# Altium schematic sheet 宠物机器人&导购机器人.SchDoc
size A2
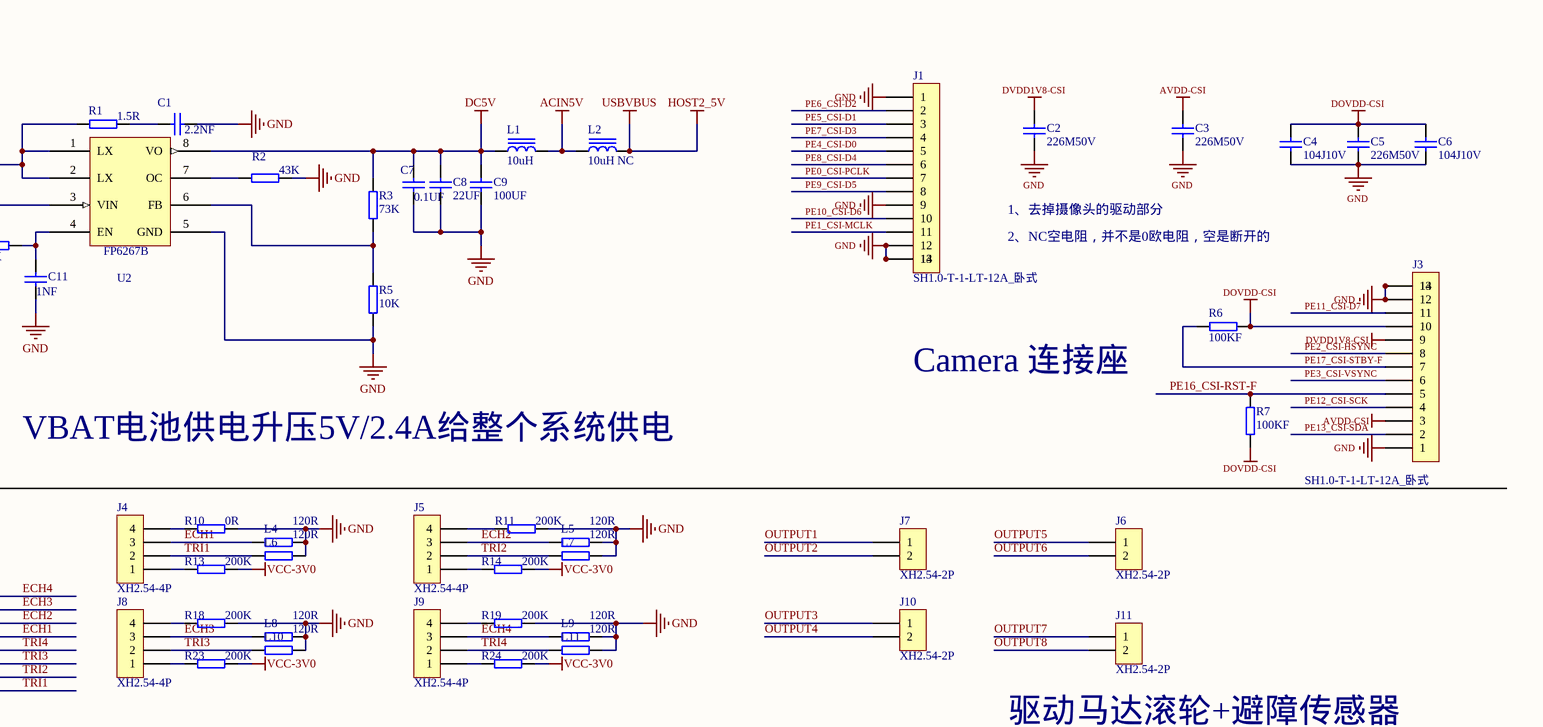
[diagram p0: 宠物机器人&导购机器人.SchDoc, top right]
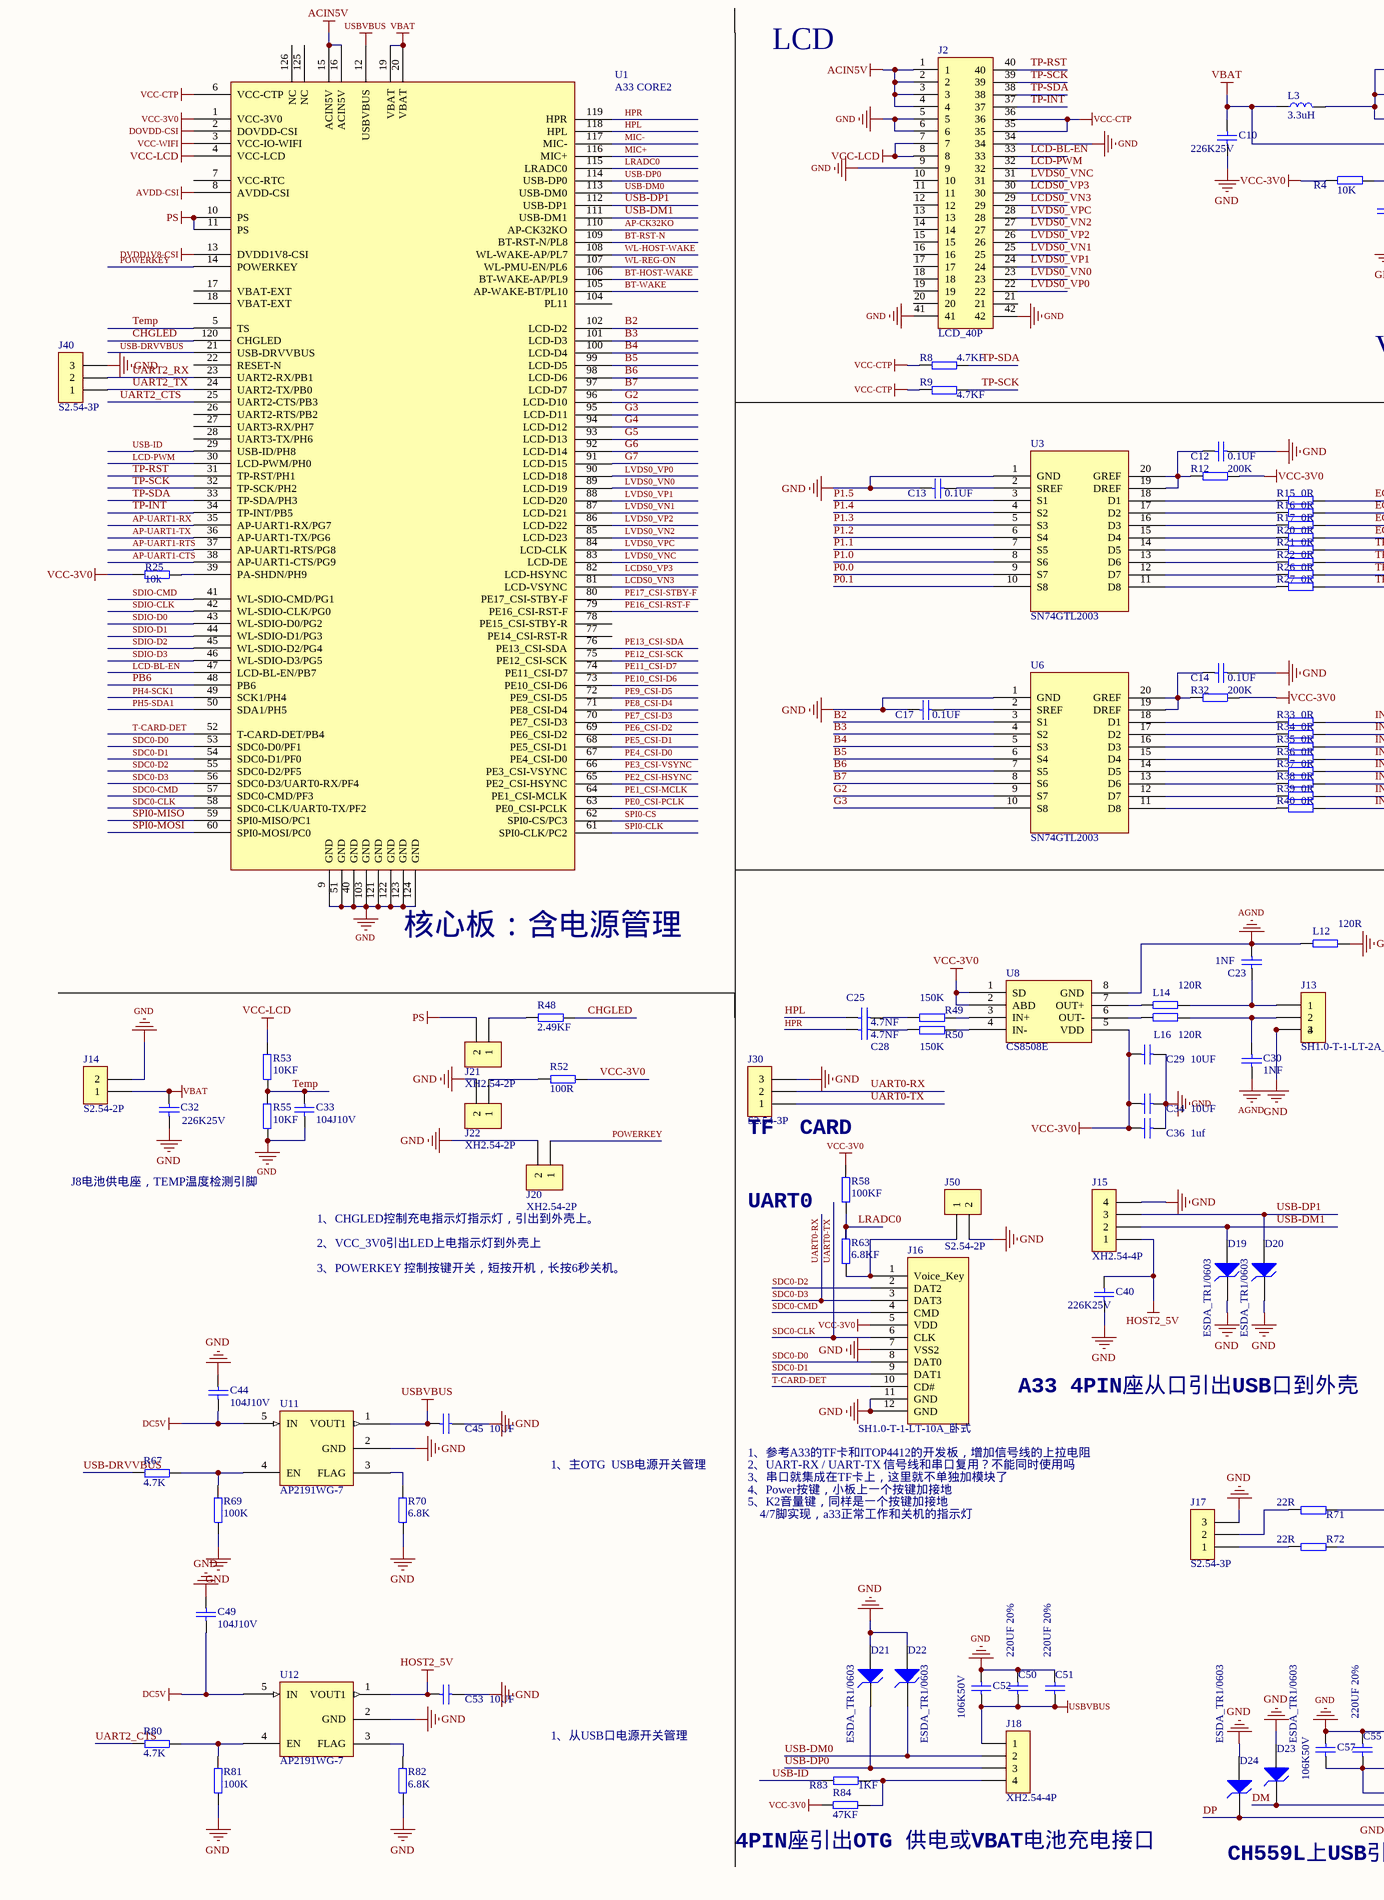
[diagram p1: 宠物机器人&导购机器人.SchDoc, bottom left]
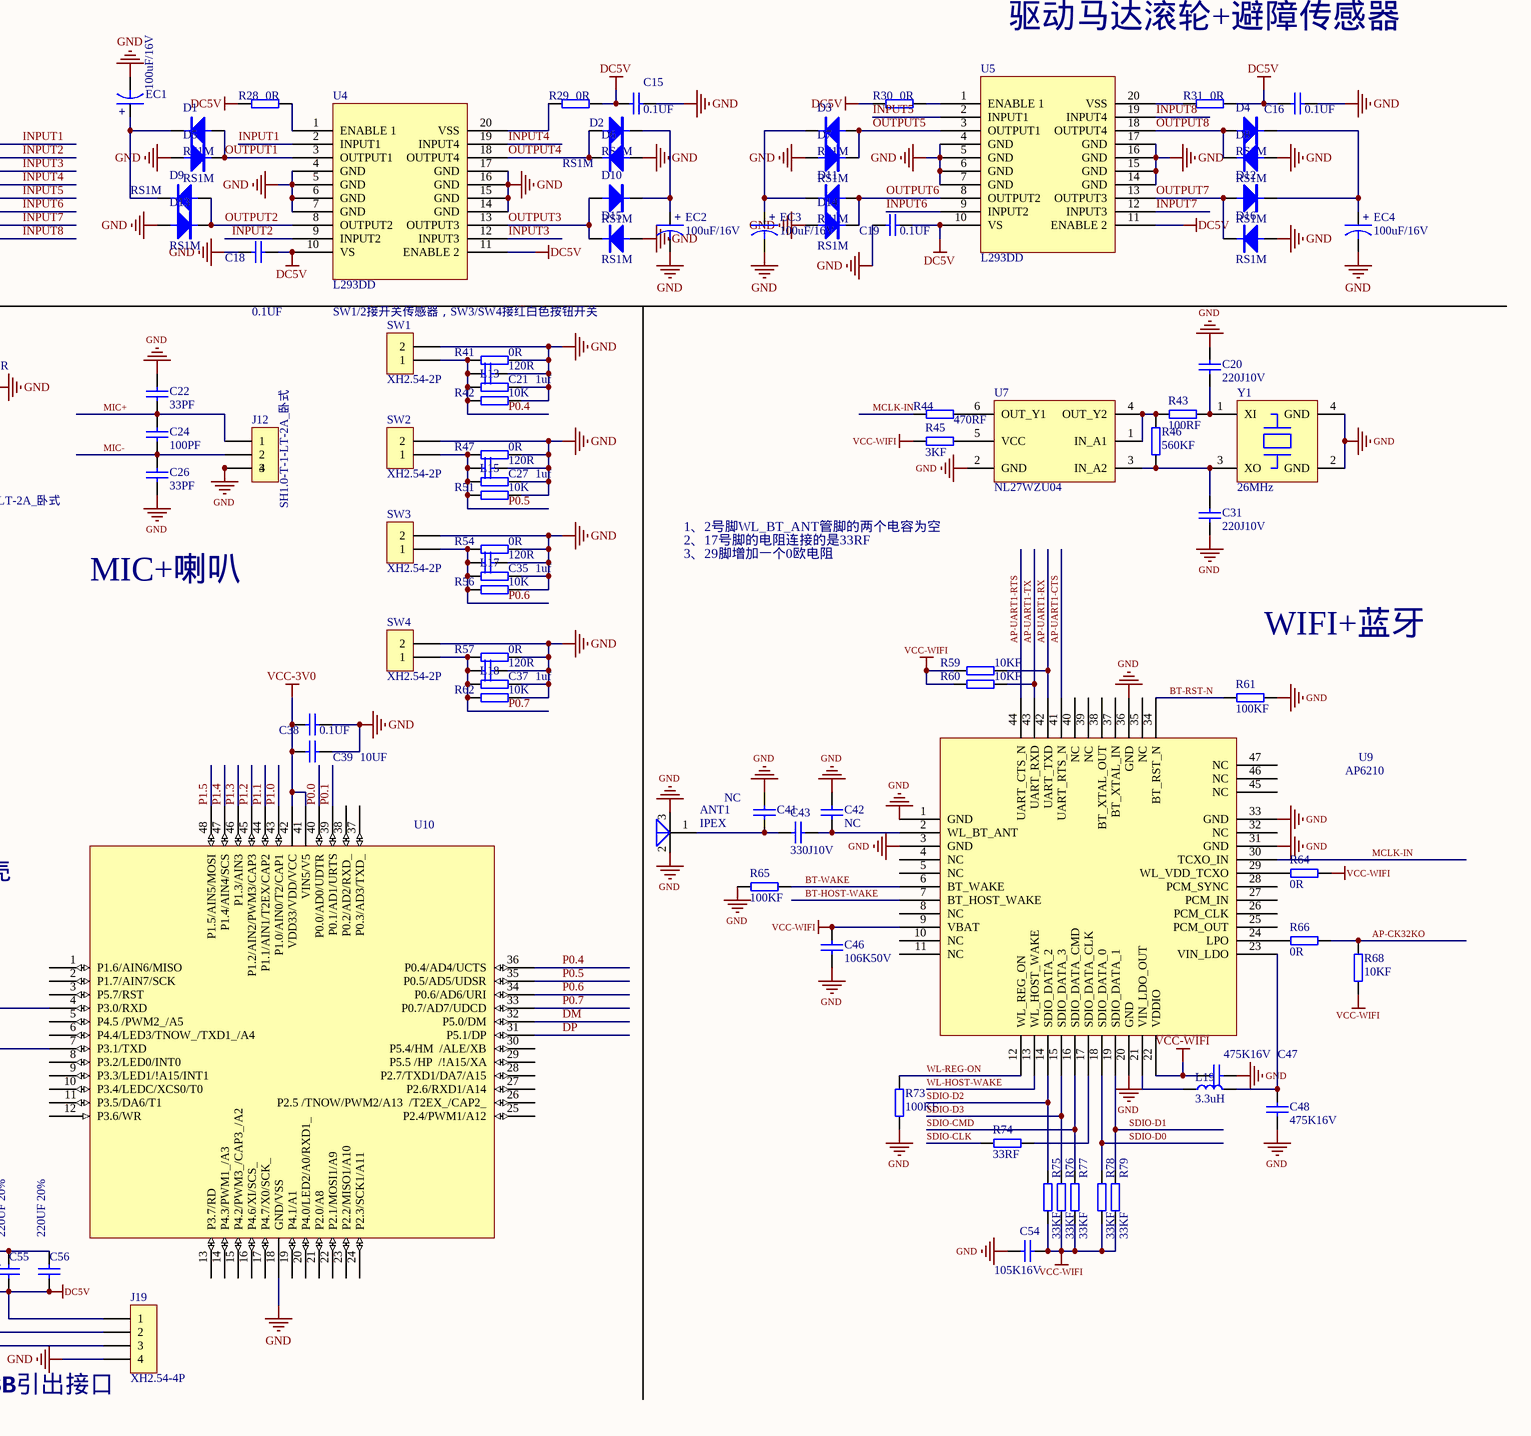
[diagram p2: 宠物机器人&导购机器人.SchDoc, bottom right]

## Parts
ANT1  IPEX  [J-IPEX]
C1  2.2NF  [C0603]
C2  226M50V  [C0805]
C3  226M50V  [C0805]
C4  104J10V  [C0402]
C5  226M50V  [C0805]
C6  104J10V  [C0402]
C7  0.1UF  [C0402]
C8  22UF  [C0603]
C9  100UF  [CD3X5.3SMD]
C10  226K25V  [C0805]
C11  1NF  [C0402]
C12  0.1UF  [C0603]
C13  0.1UF  [C0603]
C14  0.1UF  [C0603]
C15  0.1UF  [C0603]
C16  0.1UF  [C0603]
C17  0.1UF  [C0603]
C18  0.1UF  [C0603]
C19  0.1UF  [C0603]
C20  220J10V  [C0402]
C21  1uf  [C0603]
C22  33PF  [C0402]
C23  1NF  [C0402]
C24  100PF  [C0402]
C25  4.7NF  [C0603]
C26  33PF  [C0402]
C27  1uf  [C0603]
C28  4.7NF  [C0603]
C29  10UF  [C0603]
C30  1NF  [C0402]
C31  220J10V  [C0402]
C32  226K25V  [C0805]
C33  104J10V  [C0402]
C34  10UF  [C0603]
C35  1uf  [C0603]
C36  1uf  [C0603]
C37  1uf  [C0603]
C38  0.1UF  [C0603]
C39  10UF  [C0603]
C40  226K25V  [C0805]
C41  NC  [C0402]
C42  NC  [C0402]
C43  330J10V  [C0402]
C44  104J10V  [C0402]
C45  10UF  [C0603]
C46  106K50V  [C0603]
C47  475K16V  [C0603]
C48  475K16V  [C0603]
C49  104J10V  [C0402]
C50  220UF 20%  [C1206]
C51  220UF 20%  [C1206]
C52  106K50V  [C0603]
C53  10UF  [C0603]
C54  105K16V  [C0603]
C55  220UF 20%  [C1206]
C56  220UF 20%  [C1206]
C57  106K50V  [C0603]
D1  RS1M  [D-SMA/DO-214AC]
D2  RS1M  [D-SMA/DO-214AC]
D3  RS1M  [D-SMA/DO-214AC]
D4  RS1M  [D-SMA/DO-214AC]
D5  RS1M  [D-SMA/DO-214AC]
D6  RS1M  [D-SMA/DO-214AC]
D7  RS1M  [D-SMA/DO-214AC]
D8  RS1M  [D-SMA/DO-214AC]
D9  RS1M  [D-SMA/DO-214AC]
D10  RS1M  [D-SMA/DO-214AC]
D11  RS1M  [D-SMA/DO-214AC]
D12  RS1M  [D-SMA/DO-214AC]
D13  RS1M  [D-SMA/DO-214AC]
D14  RS1M  [D-SMA/DO-214AC]
D15  RS1M  [D-SMA/DO-214AC]
D16  RS1M  [D-SMA/DO-214AC]
D19  ESDA_TR1/0603  [HS_0603D]
D20  ESDA_TR1/0603  [HS_0603D]
D21  ESDA_TR1/0603  [HS_0603D]
D22  ESDA_TR1/0603  [HS_0603D]
D23  ESDA_TR1/0603  [HS_0603D]
D24  ESDA_TR1/0603  [HS_0603D]
EC1  100uF/16V  [CD6.3x8SMD]
EC2  100uF/16V  [CD6.3x8SMD]
EC3  100uF/16V  [CD6.3x8SMD]
EC4  100uF/16V  [CD6.3x8SMD]
J1  SH1.0-T-1-LT-12A_卧式  [J-SH1.0-T-1-LT-12A_立式]
J2  LCD_40P  [LCD P40]
J3  SH1.0-T-1-LT-12A_卧式  [J-SH1.0-T-1-LT-12A_立式]
J4  XH2.54-4P  [XH2.54-4P]
J5  XH2.54-4P  [XH2.54-4P]
J6  XH2.54-2P  [XH2.54-2P]
J7  XH2.54-2P  [XH2.54-2P]
J8  XH2.54-4P  [XH2.54-4P]
J9  XH2.54-4P  [XH2.54-4P]
J10  XH2.54-2P  [XH2.54-2P]
J11  XH2.54-2P  [XH2.54-2P]
J12  SH1.0-T-1-LT-2A_卧式  [J-SH2.0-T-1-LT-2A_立式]
J13  SH1.0-T-1-LT-2A_卧式  [J-SH2.0-T-1-LT-2A_立式]
J14  S2.54-2P  [S2.54-2P]
J15  XH2.54-4P  [XH2.54-4P]
J16  SH1.0-T-1-LT-10A_卧式  [J-SH1.0-T-1-LT-10A_立式]
J17  S2.54-3P  [S2.54-3P]
J18  XH2.54-4P  [XH2.54-4P]
J19  XH2.54-4P  [XH2.54-4P]
J20  XH2.54-2P  [XH2.54-2P]
J21  XH2.54-2P  [XH2.54-2P]
J22  XH2.54-2P  [XH2.54-2P]
J30  S2.54-3P  [S2.54-3P]
J40  S2.54-3P  [S2.54-3P]
J50  S2.54-2P  [S2.54-2P]
L1  10uH  [C0603]
L2  10uH NC  [C0603]
L3  3.3uH  [LSMD3521]
L4  120R  [R0603]
L5  120R  [R0603]
L6  120R  [R0603]
L7  120R  [R0603]
L8  120R  [R0603]
L9  120R  [R0603]
L10  120R  [R0603]
L11  120R  [R0603]
L12  120R  [R0603]
L13  120R  [R0603]
L14  120R  [R0603]
L15  120R  [R0603]
L16  120R  [R0603]
L17  120R  [R0603]
L18  120R  [R0603]
L19  3.3uH  [L0805]
R1  1.5R  [R0603]
R2  43K  [R0603]
R3  73K  [R0603]
R4  10K  [R0603]
R5  10K  [R0603]
R6  100KF  [R0603]
R7  100KF  [R0603]
R8  4.7KF  [R0402]
R9  4.7KF  [R0402]
R10  0R  [R0402]
R11  200K  [R0402]
R12  200K  [R0402]
R13  200K  [R0402]
R14  200K  [R0402]
R15  0R  [R0603]
R16  0R  [R0603]
R17  0R  [R0603]
R18  200K  [R0402]
R19  200K  [R0402]
R20  0R  [R0603]
R21  0R  [R0603]
R22  0R  [R0603]
R23  200K  [R0402]
R24  200K  [R0402]
R25  10k  [R0603]
R26  0R  [R0603]
R27  0R  [R0603]
R28  0R  [R0603]
R29  0R  [R0603]
R30  0R  [R0603]
R31  0R  [R0603]
R32  200K  [R0402]
R33  0R  [R0603]
R34  0R  [R0603]
R35  0R  [R0603]
R36  0R  [R0603]
R37  0R  [R0603]
R38  0R  [R0603]
R39  0R  [R0603]
R40  0R  [R0603]
R41  0R  [R0603]
R42  10K  [R0603]
R43  100RF  [R0603]
R44  470RF  [R0603]
R45  3KF  [R0603]
R46  560KF  [R0603]
R47  0R  [R0603]
R48  2.49KF  [R0603]
R49  150K  [R0603]
R50  150K  [R0603]
R51  10K  [R0603]
R52  100R  [R0603]
R53  10KF  [R0603]
R54  0R  [R0603]
R55  10KF  [R0603]
R56  10K  [R0603]
R57  0R  [R0603]
R58  100KF  [R0603]
R59  10KF  [R0603]
R60  10KF  [R0603]
R61  100KF  [R0603]
R62  10K  [R0603]
R63  6.8KF  [R0603]
R64  0R  [R0603]
R65  100KF  [R0603]
R66  0R  [R0603]
R67  4.7K  [R0603]
R68  10KF  [R0603]
R69  100K  [R0603]
R70  6.8K  [R0603]
R71  22R  [R0603]
R72  22R  [R0603]
R73  100KF  [R0603]
R74  33RF  [R0603]
R75  33KF  [R0603]
R76  33KF  [R0603]
R77  33KF  [R0603]
R78  33KF  [R0603]
R79  33KF  [R0603]
R80  4.7K  [R0603]
R81  100K  [R0603]
R82  6.8K  [R0603]
R83  1KF  [R0603]
R84  47KF  [R0603]
SW1  XH2.54-2P  [XH2.54-2P]
SW2  XH2.54-2P  [XH2.54-2P]
SW3  XH2.54-2P  [XH2.54-2P]
SW4  XH2.54-2P  [XH2.54-2P]
U1  A33 CORE2  [A33-CORE2]
U2  FP6267B  [U-SOP-8N-1]
U3  SN74GTL2003  [U-TSSOP20 - duplicate]
U4  L293DD  [S020]
U5  L293DD  [S020]
U6  SN74GTL2003  [U-TSSOP20 - duplicate]
U7  NL27WZU04  [U-TSOP-6]
U8  CS8508E  [SO-8]
U9  AP6210  [AP6210]
U10  CH559L  [LQFP48]  (value not drawn)
U11  AP2191WG-7  [SOT23-5]
U12  AP2191WG-7  [SOT23-5]
Y1  26MHz  [Y-CPX-32GA-4P]

## Nets
ACIN5V: J2.1 J2.2 J2.3 J2.4 L1.2 L2.1 U1.15(ACIN5V) U1.16(ACIN5V)
AGND: C23.2 C30.2 L12.2 U8.8(GND)
AVDD-CSI: C3.1 J3.3 U1.8(AVDD-CSI)
DC5V: C7.1 C8.2 C9.2 C15.1 C16.1 C18.2 C19.2 C44.2 C49.2 C55.1 C56.1 C57.2 J19.1 L1.1 R3.2 R28.2 R29.1 R30.2 R31.1 U2.8(VO) U4.10(VS) U4.11(ENABLE_2) U5.10(VS) U5.11(ENABLE_2) U11.5(IN) U12.5(IN)
DOVDD-CSI: C4.1 C5.1 C6.1 J3.10 R6.2 R7.1 U1.2(DOVDD-CSI)
DVDD1V8-CSI: C2.1 J3.9 U1.13(DVDD1V8-CSI)
GND: ANT1.2 ANT1.3 C1.2 C2.2 C3.2 C4.2 C5.2 C6.2 C7.2 C8.1 C9.1 C10.1 C11.2 C12.2 C13.1 C14.2 C15.2 C16.2 C17.1 C18.1 C19.1 C20.2 C21.2 C22.1 C26.2 C27.2 C29.2 C31.2 C32.2 C33.2 C34.2 C35.2 C36.2 C37.2 C38.2 C39.2 C40.1 C41.1 C42.1 C44.1 C45.2 C46.2 C47.1 C48.1 C49.1 C50.2 C51.2 C52.1 C53.2 C54.2 C55.2 C56.2 C57.1 D5.1 D6.1 D7.1 D8.1 D13.1 D14.1 D15.1 D16.1 D19.2(K) D20.2(K) D21.1(A) D22.1(A) D23.1(A) D24.1(A) EC1.2 EC2.2 EC3.2 EC4.2 J1.1 J1.9 J1.12 J1.13 J1.14 J2.5 J2.6 J2.9 J2.34 J2.41 J2.42 J3.1 J3.12 J3.13 J3.14 J12.3 J12.4 J13.3 J13.4 J14.2 J15.4 J16.7(VSS2) J16.11(GND) J16.12(GND) J17.3 J19.4 J20.2 J22.2 J30.3 J40.3 J50.2 L4.1 L5.1 L6.1 L7.1 L8.1 L9.1 L10.1 L11.1 L12.1 L13.1 L15.1 L17.1 L18.1 R2.1 R5.1 R10.2 R11.2 R18.2 R19.2 R41.2 R42.2 R47.2 R51.2 R54.2 R55.1 R56.2 R57.2 R61.2 R62.2 R65.2 R69.1 R70.1 R73.2 R81.1 R82.1 SW1.2 SW2.2 SW3.2 SW4.2 U1.9(GND) U1.40(GND) U1.51(GND) U1.103(GND) U1.121(GND) U1.122(GND) U1.123(GND) U1.124(GND) U2.5(GND) U3.1(GND) U4.4(GND) U4.5(GND) U4.6(GND) U4.7(GND) U4.14(GND) U4.15(GND) U4.16(GND) U4.17(GND) U5.4(GND) U5.5(GND) U5.6(GND) U5.7(GND) U5.14(GND) U5.15(GND) U5.16(GND) U5.17(GND) U6.1(GND) U7.2(GND) U9.1(GND) U9.3(GND) U9.20(GND) U9.31(GND) U9.33(GND) U9.36(GND) U10.18(GND/VSS) U11.2(GND) U12.2(GND) Y1.2(GND) Y1.4(GND)
HOST2_5V: C40.2 C45.1 C50.1 C51.1 C52.2 C53.1 J15.1 J18.1 L2.2 U1.12(USBVBUS) U11.1(VOUT1) U12.1(VOUT1)  [also labelled USBVBUS]
PS: J21.2 U1.10(PS) U1.11(PS)
VBAT: C10.2 C32.1 J14.1 L3.1 U1.19(VBAT) U1.20(VBAT) U2.3(VIN)
VCC-3V0: C29.1 C34.1 C36.1 C38.1 C39.1 J16.5(VDD) R4.2 R12.2 R13.2 R14.2 R23.2 R24.2 R25.1 R32.2 R52.2 R58.1 R84.2 U1.1(VCC-3V0) U8.1(SD) U8.2(ABD) U8.5(VDD) U10.41(VIN5/V5) U10.42(VDD33/VDD/VCC)
VCC-CTP: J2.35 J2.36 R8.1 R9.1 U1.6(VCC-CTP)
VCC-LCD: J2.7 J2.8 R53.2 U1.4(VCC-LCD)
VCC-WIFI: C46.1 C47.2 C54.1 R45.1 R59.1 R60.1 R64.2 R68.1 R75.1 R76.1 R77.1 R78.1 R79.1 U1.3(VCC-IO-WIFI) U9.9(VBAT) U9.22(VDDIO)
AP-CK32KO: R66.2 R68.2 U1.110(AP-CK32KO)
AP-UART1-CTS: U1.38(AP-UART1-CTS/PG9) U9.41(UART_RTS_N)
AP-UART1-RTS: U1.37(AP-UART1-RTS/PG8) U9.44(UART_CTS_N)
AP-UART1-RX: R59.2 U1.35(AP-UART1-RX/PG7) U9.42(UART_TXD)
AP-UART1-TX: R60.2 U1.36(AP-UART1-TX/PG6) U9.43(UART_RXD)
B2: U1.102(LCD-D2) U6.3(S1)
B3: U1.101(LCD-D3) U6.4(S2)
B4: U1.100(LCD-D4) U6.5(S3)
B5: U1.99(LCD-D5) U6.6(S4)
B6: U1.98(LCD-D6) U6.7(S5)
B7: U1.97(LCD-D7) U6.8(S6)
BT-HOST-WAKE: U1.106(BT-WAKE-AP/PL9) U9.7(BT_HOST_WAKE)
BT-RST-N: R61.1 U1.109(BT-RST-N/PL8) U9.34(BT_RST_N)
BT-WAKE: R65.1 U1.105(AP-WAKE-BT/PL10) U9.6(BT_WAKE)
CHGLED: R48.2 U1.120(CHGLED)
DM: D23.2(K) J19.2 U10.32(P5.0/DM)
DP: D24.2(K) J19.3 U10.31(P5.1/DP)
ECH1: J4.3 L4.2 R20.1
ECH2: J5.3 L5.2 R17.1
ECH3: J8.3 L8.2 R16.1
ECH4: J9.3 L9.2 R15.1
G2: U1.96(LCD-D10) U6.9(S7)
G3: U1.95(LCD-D11) U6.10(S8)
G4: U1.94(LCD-D12)
G5: U1.93(LCD-D13)
G6: U1.92(LCD-D14)
G7: U1.91(LCD-D15)
HPL: C25.1 U1.118(HPL)
HPR: C28.1 U1.119(HPR)
INPUT1: R33.1 U4.2(INPUT1)
INPUT2: R34.1 U4.9(INPUT2)
INPUT3: R35.1 U4.12(INPUT3)
INPUT4: R36.1 U4.19(INPUT4)
INPUT5: R37.1 U5.2(INPUT1)
INPUT6: R38.1 U5.9(INPUT2)
INPUT7: R39.1 U5.12(INPUT3)
INPUT8: R40.1 U5.19(INPUT4)
LCD-BL-EN: J2.33 U1.47(LCD-BL-EN/PB7)
LCD-PWM: J2.32 U1.30(LCD-PWM/PH0)
LCDS0_VN3: J2.29 U1.81(LCD-VSYNC)
LCDS0_VP3: J2.30 U1.82(LCD-HSYNC)
LRADC0: R58.2 R63.1 U1.115(LRADC0)
LVDS0_VN0: J2.23 U1.89(LCD-D19)
LVDS0_VN1: J2.25 U1.87(LCD-D21)
LVDS0_VN2: J2.27 U1.85(LCD-D23)
LVDS0_VNC: J2.31 U1.83(LCD-DE)
LVDS0_VP0: J2.22 U1.90(LCD-D18)
LVDS0_VP1: J2.24 U1.88(LCD-D20)
LVDS0_VP2: J2.26 U1.86(LCD-D22)
LVDS0_VPC: J2.28 U1.84(LCD-CLK)
MCLK-IN: R44.1 U9.30(TCXO_IN)
MIC+: C22.2 C24.1 J12.1 U1.116(MIC+)
MIC-: C24.2 C26.1 J12.2 U1.117(MIC-)
OUTPUT1: D1.1 D5.2 J7.1 U4.3(OUTPUT1)
OUTPUT2: D9.1 D13.2 J7.2 U4.8(OUTPUT2)
OUTPUT3: D10.1 D15.2 J10.1 U4.13(OUTPUT3)
OUTPUT4: D2.1 D6.2 J10.2 U4.18(OUTPUT4)
OUTPUT5: D3.1 D7.2 J6.1 U5.3(OUTPUT1)
OUTPUT6: D11.1 D14.2 J6.2 U5.8(OUTPUT2)
OUTPUT7: D12.1 D16.2 J11.1 U5.13(OUTPUT3)
OUTPUT8: D4.1 D8.2 J11.2 U5.18(OUTPUT4)
P0.0: U3.9(S7) U10.40(P0.0/AD0/UDTR)
P0.1: U3.10(S8) U10.39(P0.1/AD1/URTS)
P0.4: C21.1 L13.2 R41.1 R42.1 SW1.1 U10.36(P0.4/AD4/UCTS)
P0.5: C27.1 L15.2 R47.1 R51.1 SW2.1 U10.35(P0.5/AD5/UDSR)
P0.6: C35.1 L17.2 R54.1 R56.1 SW3.1 U10.34(P0.6/AD6/URI)
P0.7: C37.1 L18.2 R57.1 R62.1 SW4.1 U10.33(P0.7/AD7/UDCD)
P1.0: U3.8(S6) U10.43(P1.0/AIN0/T2/CAP1)
P1.1: U3.7(S5) U10.44(P1.1/AIN1/T2EX/CAP2)
P1.2: U3.6(S4) U10.45(P1.2/AIN2/PWM3/CAP3)
P1.3: U3.5(S3) U10.46(P1.3/AIN3)
P1.4: U3.4(S2) U10.47(P1.4/AIN4/SCS)
P1.5: U3.3(S1) U10.48(P1.5/AIN5/MOSI)
PB6: U1.48(PB6)
PE0_CSI-PCLK: J1.7 U1.63(PE0_CSI-PCLK)
PE1_CSI-MCLK: J1.11 U1.64(PE1_CSI-MCLK)
PE2_CSI-HSYNC: J3.8 U1.65(PE2_CSI-HSYNC)
PE3_CSI-VSYNC: J3.6 U1.66(PE3_CSI-VSYNC)
PE4_CSI-D0: J1.5 U1.67(PE4_CSI-D0)
PE5_CSI-D1: J1.3 U1.68(PE5_CSI-D1)
PE6_CSI-D2: J1.2 U1.69(PE6_CSI-D2)
PE7_CSI-D3: J1.4 U1.70(PE7_CSI-D3)
PE8_CSI-D4: J1.6 U1.71(PE8_CSI-D4)
PE9_CSI-D5: J1.8 U1.72(PE9_CSI-D5)
PE10_CSI-D6: J1.10 U1.73(PE10_CSI-D6)
PE11_CSI-D7: J3.11 U1.74(PE11_CSI-D7)
PE12_CSI-SCK: J3.4 U1.75(PE12_CSI-SCK)
PE13_CSI-SDA: J3.2 U1.76(PE13_CSI-SDA)
PE16_CSI-RST-F: J3.5 R7.2 U1.79(PE16_CSI-RST-F)
PE17_CSI-STBY-F: J3.7 R6.1 U1.80(PE17_CSI-STBY-F)
PH4-SCK1: U1.49(SCK1/PH4)
PH5-SDA1: U1.50(SDA1/PH5)
POWERKEY: J20.1 U1.14(POWERKEY)
SDC0-CLK: J16.6(CLK) J30.1 U1.58(SDC0-CLK/UART0-TX/PF2)  [also labelled UART0-TX]
SDC0-CMD: J16.4(CMD) U1.57(SDC0-CMD/PF3)
SDC0-D0: J16.8(DAT0) U1.53(SDC0-D0/PF1)
SDC0-D1: J16.9(DAT1) U1.54(SDC0-D1/PF0)
SDC0-D2: J16.2(DAT2) U1.55(SDC0-D2/PF5)
SDC0-D3: J16.3(DAT3) J30.2 U1.56(SDC0-D3/UART0-RX/PF4)  [also labelled UART0-RX]
SDIO-CLK: R74.2 U1.42(WL-SDIO-CLK/PG0)
SDIO-CMD: R77.2 U1.41(WL-SDIO-CMD/PG1) U9.16(SDIO_DATA_CMD)
SDIO-D0: R78.2 U1.43(WL-SDIO-D0/PG2) U9.18(SDIO_DATA_0)
SDIO-D1: R79.2 U1.44(WL-SDIO-D1/PG3) U9.19(SDIO_DATA_1)
SDIO-D2: R75.2 U1.45(WL-SDIO-D2/PG4) U9.14(SDIO_DATA_2)
SDIO-D3: R76.2 U1.46(WL-SDIO-D3/PG5) U9.15(SDIO_DATA_3)
SPI0-CLK: U1.61(SPI0-CLK/PC2)
SPI0-CS: U1.62(SPI0-CS/PC3)
SPI0-MISO: U1.59(SPI0-MISO/PC1)
SPI0-MOSI: U1.60(SPI0-MOSI/PC0)
T-CARD-DET: J16.10(CD#) U1.52(T-CARD-DET/PB4)
Temp: C33.1 R53.1 R55.2 U1.5(TS)
TP-INT: J2.37 U1.34(TP-INT/PB5)
TP-RST: J2.40 U1.31(TP-RST/PH1)
TP-SCK: J2.39 R9.2 U1.32(TP-SCK/PH2)
TP-SDA: J2.38 R8.2 U1.33(TP-SDA/PH3)
TRI1: J4.2 L6.2 R27.1
TRI2: J5.2 L7.2 R26.1
TRI3: J8.2 L10.2 R22.1
TRI4: J9.2 L11.2 R21.1
UART2_CTS: R80.1 U1.25(UART2-CTS/PB3)
UART2_RX: J40.2 U1.23(UART2-RX/PB1)
UART2_TX: J40.1 U1.24(UART2-TX/PB0)
USB-DM0: D22.2(K) J18.2 U1.113(USB-DM0)
USB-DM1: D19.1(A) J15.2 U1.111(USB-DM1)
USB-DP0: D21.2(K) J18.3 U1.114(USB-DP0)
USB-DP1: D20.1(A) J15.3 U1.112(USB-DP1)
USB-DRVVBUS: R67.1 U1.21(USB-DRVVBUS)
USB-ID: R83.1 U1.29(USB-ID/PH8)
WL-HOST-WAKE: U1.108(WL-WAKE-AP/PL7) U9.13(WL_HOST_WAKE)
WL-REG-ON: R73.1 U1.107(WL-PMU-EN/PL6) U9.12(WL_REG_ON)
NetANT1_1: ANT1.1(W) C41.2 C43.2
NetC1_1: C1.1 R1.1
NetC11_1: C11.1 R4.1 U2.4(EN)
NetC12_1: C12.1 R12.1 U3.19(DREF) U3.20(GREF)
NetC13_2: C13.2 U3.2(SREF)
NetC14_1: C14.1 R32.1 U6.19(DREF) U6.20(GREF)
NetC17_2: C17.2 U6.2(SREF)
NetC20_1: C20.1 R43.2 Y1.1(XI)
NetC23_1: C23.1 J13.1 L14.1
NetC25_2: C25.2 R49.1
NetC28_2: C28.2 R50.1
NetC30_1: C30.1 J13.2 L16.1
NetC31_1: C31.1 R46.1 U7.3(IN_A2) Y1.3(XO)
NetC42_2: C42.2 C43.1 U9.2(WL_BT_ANT)
NetC48_2: C48.2 L19.2 U9.23(VIN_LDO)
NetD1_2: D1.2 D9.2 EC1.1
NetD2_2: D2.2 D10.2 EC2.1
NetD3_2: D3.2 D11.2 EC3.1
NetD4_2: D4.2 D12.2 EC4.1
NetJ4_1: J4.1 R13.1
NetJ4_4: J4.4 R10.1
NetJ5_1: J5.1 R14.1
NetJ5_4: J5.4 R11.1
NetJ8_1: J8.1 R23.1
NetJ8_4: J8.4 R18.1
NetJ9_1: J9.1 R24.1
NetJ9_4: J9.4 R19.1
NetJ16_1: J16.1(Voice_Key) J50.1 R63.2
NetJ17_1: J17.1 R72.1
NetJ17_2: J17.2 R71.1
NetJ18_4: J18.4 R83.2 R84.1
NetJ21_1: J21.1 R48.1
NetJ22_1: J22.1 R52.1
NetL3_2: L3.2 R1.2 U2.1(LX) U2.2(LX)
NetL14_2: L14.2 U8.7(OUT+)
NetL16_2: L16.2 U8.6(OUT-)
NetL19_1: L19.1 U9.21(VIN_LDO_OUT)
NetR2_2: R2.2 U2.7(OC)
NetR3_1: R3.1 R5.2 U2.6(FB)
NetR15_2: R15.2 U3.18(D1)
NetR16_2: R16.2 U3.17(D2)
NetR17_2: R17.2 U3.16(D3)
NetR20_2: R20.2 U3.15(D4)
NetR21_2: R21.2 U3.14(D5)
NetR22_2: R22.2 U3.13(D6)
NetR25_2: R25.2 U1.39(PA-SHDN/PH9)
NetR26_2: R26.2 U3.12(D7)
NetR27_2: R27.2 U3.11(D8)
NetR28_1: R28.1 U4.1(ENABLE_1)
NetR29_2: R29.2 U4.20(VSS)
NetR30_1: R30.1 U5.1(ENABLE_1)
NetR31_2: R31.2 U5.20(VSS)
NetR33_2: R33.2 U6.18(D1)
NetR34_2: R34.2 U6.17(D2)
NetR35_2: R35.2 U6.16(D3)
NetR36_2: R36.2 U6.15(D4)
NetR37_2: R37.2 U6.14(D5)
NetR38_2: R38.2 U6.13(D6)
NetR39_2: R39.2 U6.12(D7)
NetR40_2: R40.2 U6.11(D8)
NetR43_1: R43.1 R46.2 U7.1(IN_A1) U7.4(OUT_Y2)
NetR44_2: R44.2 U7.6(OUT_Y1)
NetR45_2: R45.2 U7.5(VCC)
NetR49_2: R49.2 U8.3(IN+)
NetR50_2: R50.2 U8.4(IN-)
NetR64_1: R64.1 U9.29(WL_VDD_TCXO)
NetR66_1: R66.1 U9.24(LPO)
NetR67_2: R67.2 R69.2 U11.4(EN)
NetR70_2: R70.2 U11.3(FLAG)
NetR71_2: R71.2 U10.4(P3.0/RXD)
NetR72_2: R72.2 U10.7(P3.1/TXD)
NetR74_1: R74.1 U9.17(SDIO_DATA_CLK)
NetR80_2: R80.2 R81.2 U12.4(EN)
NetR82_2: R82.2 U12.3(FLAG)

Not connected (* = marked no-connect by the designer): J2 10 11 12 13 14 15 16 17 18 19 20 21; U1 7(VCC-RTC) 17(VBAT-EXT) 18(VBAT-EXT) 22(RESET-N) 26(UART2-RTS/PB2) 27(UART3-RX/PH7) 28(UART3-TX/PH6) 77(PE14_CSI-RST-R) 78(PE15_CSI-STBY-R) 104(PL11) 125(NC) 126(NC); U9 4(NC) 5(NC) 8(NC) 10(NC) 11(NC) 25(PCM_OUT) 26(PCM_CLK) 27(PCM_IN) 28(PCM_SYNC) 32(NC) 35(NC) 37(BT_XTAL_IN) 38(BT_XTAL_OUT) 39(NC) 40(NC) 45(NC) 46(NC) 47(NC); U10 1(P1.6/AIN6/MISO) 2(P1.7/AIN7/SCK) 3(P5.7/RST) 5(P4.5_/PWM2_/A5) 6(P4.4/LED3/TNOW_/TXD1_/A4) 8(P3.2/LED0/INT0) 9(P3.3/LED1/!A15/INT1) 10(P3.4/LEDC/XCS0/T0) 11(P3.5/DA6/T1) 12(P3.6/WR) 13(P3.7/RD) 14(P4.3/PWM1_/A3) 15(P4.2/PWM3_/CAP3_/A2) 16(P4.6/XI/SCS_) 17(P4.7/X0/SCK_) 19(P4.1/A1) 20(P4.0/LED2/A0/RXD1_) 21(P2.0/A8) 22(P2.1/MOSI1/A9) 23(P2.2/MISO1/A10) 24(P2.3/SCK1/A11) 25(P2.4/PWM1/A12) 26(P2.5_/TNOW/PWM2/A13__/T2EX_/CAP2_) 27(P2.6/RXD1/A14) 28(P2.7/TXD1/DA7/A15) 29(P5.5_/HP__/!A15/XA) 30(P5.4/HM__/ALE/XB) 37(P0.3/AD3/TXD_) 38(P0.2/AD2/RXD_)

## Notes on the sheet
- LCD
- 1、去掉摄像头的驱动部分
- 2、NC空电阻，并不是0欧电阻，空是断开的
- Camera 连接座
- VBAT电池供电升压5V/2.4A给整个系统供电
- 驱动马达滚轮+避障传感器
- SW1/2接开关传感器，SW3/SW4接红白色按钮开关
- (near U1) 核心板：含电源管理
- MIC+喇叭
- 1、2号脚WL_BT_ANT管脚的两个电容为空
- 2、17号脚的电阻连接的是33RF
- 3、29脚增加一个0欧电阻
- J8电池供电座，TEMP温度检测引脚
- (near J30) TF  CARD
- WIFI+蓝牙
- 1、CHGLED控制充电指示灯指示灯，引出到外壳上。
- 2、VCC_3V0引出LED上电指示灯到外壳上
- UART0
- 3、POWERKEY 控制按键开关，短按开机，长按6秒关机。
- A33 4PIN座从口引出USB口到外壳
- 1、主OTG  USB电源开关管理
- 4、Power按键，小板上一个按键加接地
- (near J16) 1、参考A33的TF卡和ITOP4412的开发板，增加信号线的上拉电阻
- (near J16) 2、UART-RX / UART-TX 信号线和串口复用？不能同时使用吗
- 3、串口就集成在TF卡上，这里就不单独加模块了
- 5、K2音量键，同样是一个按键加接地
- 4/7脚实现，a33正常工作和关机的指示灯
- 1、从USB口电源开关管理
- (near R84) 4PIN座引出OTG 供电或VBAT电池充电接口
- CH559L上USB引出接口
- (in symbol CES-100uF/16V) +

## Library data of the parts
ANT1 = J-IPEX: 天线接口IPEX
C1 C8 C9 C12-C19 C21 C25 C27-C29 C34-C39 C45 C53 = C0603X7R-330J25V: 贴片电容-陶瓷; 规格型号: 33pF±5%_25V_X7R_C0603; 生产商: 风华 三星; 供应商: *; 备注: *
C2 C3 C5 = C0805Y5V-226M50V: 贴片电容-陶瓷; 规格型号: 22uF±20%_50V_Y5V_C0805; 生产商: 风华 三星; 供应商: *; 备注: *
C4 C6 C22 C24 C26 C33 C44 C49 = C0402X7R-104J10V: 贴片电容-陶瓷; 规格型号: 100nF±5%_10V_X7R_C0402; 生产商: 风华 三星; 供应商: *; 备注: *
C7 C11 = C0402X7R-101J10V: 贴片电容-陶瓷; 规格型号: 100pF±5%_10V_X7R_C0402; 生产商: 风华 三星; 供应商: *; 备注: *
C10 C32 C40 = C0805X7R-226K25V: 贴片电容-陶瓷; 规格型号: 22uF±10%_25V_X7R_C0805; 生产商: 风华 三星; 供应商: *; 备注: *
C20 C23 C30 C31 C41 C42 = C0402X7R-220J10V: 贴片电容-陶瓷; 规格型号: 22pF±5%_10V_X7R_C0402; 生产商: 风华 三星; 供应商: *; 备注: *
C43 = C0402X7R-330J10V: 贴片电容-陶瓷; 规格型号: 33pF±5%_10V_X7R_C0402; 生产商: 风华 三星; 供应商: *; 备注: *
C46 C52 C57 = C0603X7R-106K50V: 贴片电容-陶瓷; 规格型号: 10uF±10%_50V_X7R_C0603; 生产商: 风华 三星; 供应商: *; 备注: *
C47 C48 = C0603X7R-475K16V: 贴片电容-陶瓷; 规格型号: 4.7uF±10%_16V_X7R_C0603; 生产商: 风华 三星; 供应商: *; 备注: *
C50 C51 C55 C56 = C1206-A型 极性电容: C 1206钽电容 --220UF 10V 3216 A型 有极性电容 3.2mm X 1.6mm; 参数: C 1206钽电容 --220UF 20% 10V 3216 A型 有极性 白色为正 电容 3.2mm X 1.6mm
C54 = C0603X7R-105K16V: 贴片电容-陶瓷; 规格型号: 1uF±10%_16V_X7R_C0603; 生产商: 风华 三星; 供应商: *; 备注: *
D1-D16 = DF-RS1M-1A1000V: 贴片二极管-快恢复; 货品编码: 321010; 生产商: *; 规格型号: RS1M-1A1000V; 供应商: *; 备注: *
D19-D24 = D Zener: Zener Diode; Published: *; LatestRevisionDate: *; LatestRevisionNote: *; PackageReference: *; Publisher: *
EC1-EC4 = CES-100uF/16V: 贴片铝电解电容; 生产商: 三星; 规格型号: 100uF_16V_±10%_+105℃; 备注: *; 供应商: *
J4 J5 J8 J9 J15 J18 J19 = J-XH2.54-4P: 接插件-2.54; 货品编码: 371015; 供应商: *; 规格型号: XH2.54-4P; 备注: *
J6 J7 J10 J11 J20-J22 SW1-SW4 = J-XH2.54-2P: 接插件-2.54; 货品编码: 371007; 供应商: *; 规格型号: XH2.54-2P; 备注: *
J14 J50 = J-S2.54-2P: 单排排针-直针; 货品编码: 372013; 供应商: *; 规格型号: S2.54-2P; 备注: *
J17 J30 J40 = J-S2.54-3P: 单排排针-直针; 货品编码: 372015; 供应商: *; 规格型号: S2.54-3P; 备注: *
L1 L2 = LI-0608-10uH1A: 插件电感-工形; 货品编码: 无样品无编码; 生产商: *; 规格型号: LI-0608-10uH1A; 供应商: *; 备注: *
L3 = 3.3uH: 贴片电感-屏蔽; 生产商: *; 供应商: *; 备注: *
L4-L18 R84 = R0603-47KF: 贴片电阻-通用; 生产商: 厚声 国巨; 规格型号: 47K±1%_1/10W_±200ppm_R0603; 货品编码: 无样品无编码; 备注: *; 供应商: *
L19 = L-0805-3.3uH: 贴片电感-层叠; 规格型号: L0805-3.3uH; 生产商: *; 供应商: *; 备注: *
R1-R5 R15-R17 R20-R22 R26-R31 R33-R40 R52 R67 R80 = R0603-2KF: 贴片电阻-通用; 生产商: 厚声 国巨; 规格型号: 2K±1%_1/10W_±200ppm_R0603; 备注: *; 供应商: *
R6 R7 R58 R61 R65 R73 = R0603-100KF: 贴片电阻-通用; 生产商: 厚声 国巨; 规格型号: 100K±1%_1/10W_±200ppm_R0603; 货品编码: 无样品无编码; 备注: *; 供应商: *
R8-R14 R18 R19 R23 R24 R32 = R0402-4.7KF: 贴片电阻-通用
R25 R41 R42 R47 R49-R51 R53-R57 R59 R60 R62 R68-R72 R81 R82 = R0603-10KF: 贴片电阻-通用; 生产商: 厚声 国巨; 规格型号: 10K±1%_1/10W_±200ppm_R0603; 备注: *; 供应商: *
R43 = R0603-100RF: 贴片电阻-通用; 生产商: 厚声 国巨; 规格型号: 100R±1%_1/10W_±200ppm_R0603; 备注: *; 供应商: *
R44 = R0603-470RF: 贴片电阻-通用; 生产商: 厚声 国巨; 规格型号: 470R±1%_1/10W_±200ppm_R0603; 货品编码: 无样品无编码; 备注: *; 供应商: *
R45 R48 = R0603-3KF: 贴片电阻-通用; 生产商: 厚声 国巨; 规格型号: 3K±1%_1/10W_±200ppm_R0603; 货品编码: 无样品无编码; 备注: *; 供应商: *
R46 = R0603-560KF: 贴片电阻-通用; 生产商: 厚声 国巨; 规格型号: 560K±1%_1/10W_±200ppm_R0603; 备注: *; 供应商: *
R63 = R0603-6.8KF: 贴片电阻-通用; 生产商: 厚声 国巨; 规格型号: 6.8K±1%_1/10W_±200ppm_R0603; 货品编码: 无样品无编码; 备注: *; 供应商: *
R64 R66 = R0603-0R: 贴片电阻-通用; 生产商: 厚声 国巨; 规格型号: 0R_1/10W_±200ppm_R0603; 货品编码: 无样品无编码; 备注: *; 供应商: *
R74 = R0603-33RF: 贴片电阻-通用; 生产商: 厚声 国巨; 规格型号: 33R±1%_1/10W_±200ppm_R0603; 货品编码: 无样品无编码; 备注: *; 供应商: *
R75-R79 = R0603-33KF: 贴片电阻-通用; 生产商: 厚声 国巨; 规格型号: 33K±1%_1/10W_±200ppm_R0603; 备注: *; 供应商: *
R83 = R0603-1KF: 贴片电阻-通用; 生产商: 厚声 国巨; 规格型号: 1K±1%_1/10W_±200ppm_R0603; 货品编码: 无样品无编码; 备注: *; 供应商: *
U10 = CH559L: 单片机
Y1 = YC-26MHz: 晶振-贴片无源; 规格型号: 26MHz_贴片晶振3225; 生产商: *; 供应商: *; 备注: *